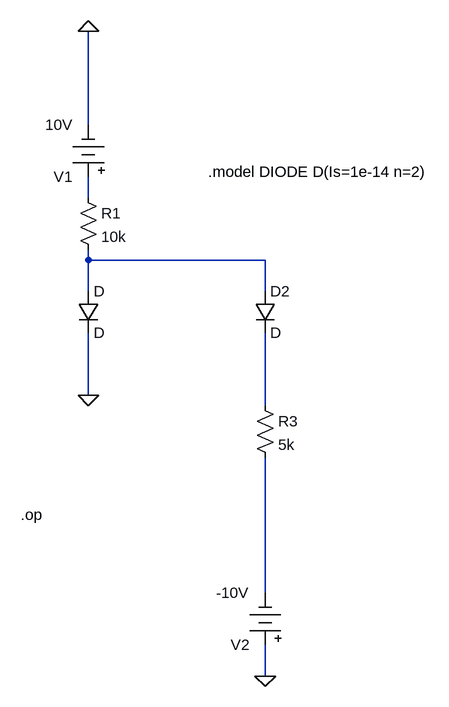
[diagram p0: schematic 3.1B.asc]
3.1B.asc, the LTspice schematic file:
Version 4
SHEET 1 1532 824
WIRE 128 -48 128 -192
WIRE 128 64 128 32
WIRE 128 160 128 144
WIRE 400 160 128 160
WIRE 128 208 128 160
WIRE 400 208 400 160
WIRE 128 368 128 272
WIRE 400 384 400 272
WIRE 400 672 400 464
WIRE 400 800 400 752
FLAG 128 368 0
FLAG 128 -192 0
FLAG 400 800 0
SYMBOL res 112 48 R0
SYMATTR InstName R1
SYMATTR Value 10k
SYMBOL Misc\\battery 128 48 R180
WINDOW 123 0 0 Left 2
WINDOW 39 0 0 Left 2
SYMATTR InstName V1
SYMATTR Value 10V
SYMBOL Misc\\battery 400 768 R180
WINDOW 123 0 0 Left 2
WINDOW 39 0 0 Left 2
SYMATTR InstName V2
SYMATTR Value -10V
SYMBOL diode 112 208 R0
SYMATTR InstName D
SYMBOL diode 384 208 R0
SYMATTR InstName D2
SYMBOL res 384 368 R0
SYMATTR InstName R3
SYMATTR Value 5k
TEXT 312 24 Left 2 !.model DIODE D(Is=1e-14 n=2)
TEXT 24 552 Left 2 !.op

The netlist it stands for:
* 3.1B.asc
R1 N001 N002 10k
V1 N001 0 10V
V2 0 N004 -10V
D N002 0 D
D2 N002 N003 D
R3 N003 N004 5k
.model D D
.lib standard.dio
.model DIODE D(Is=1e-14 n=2)
.op
.backanno
.end